# EAGLE schematic PPU_LITE (EAGLE 9.6.2)
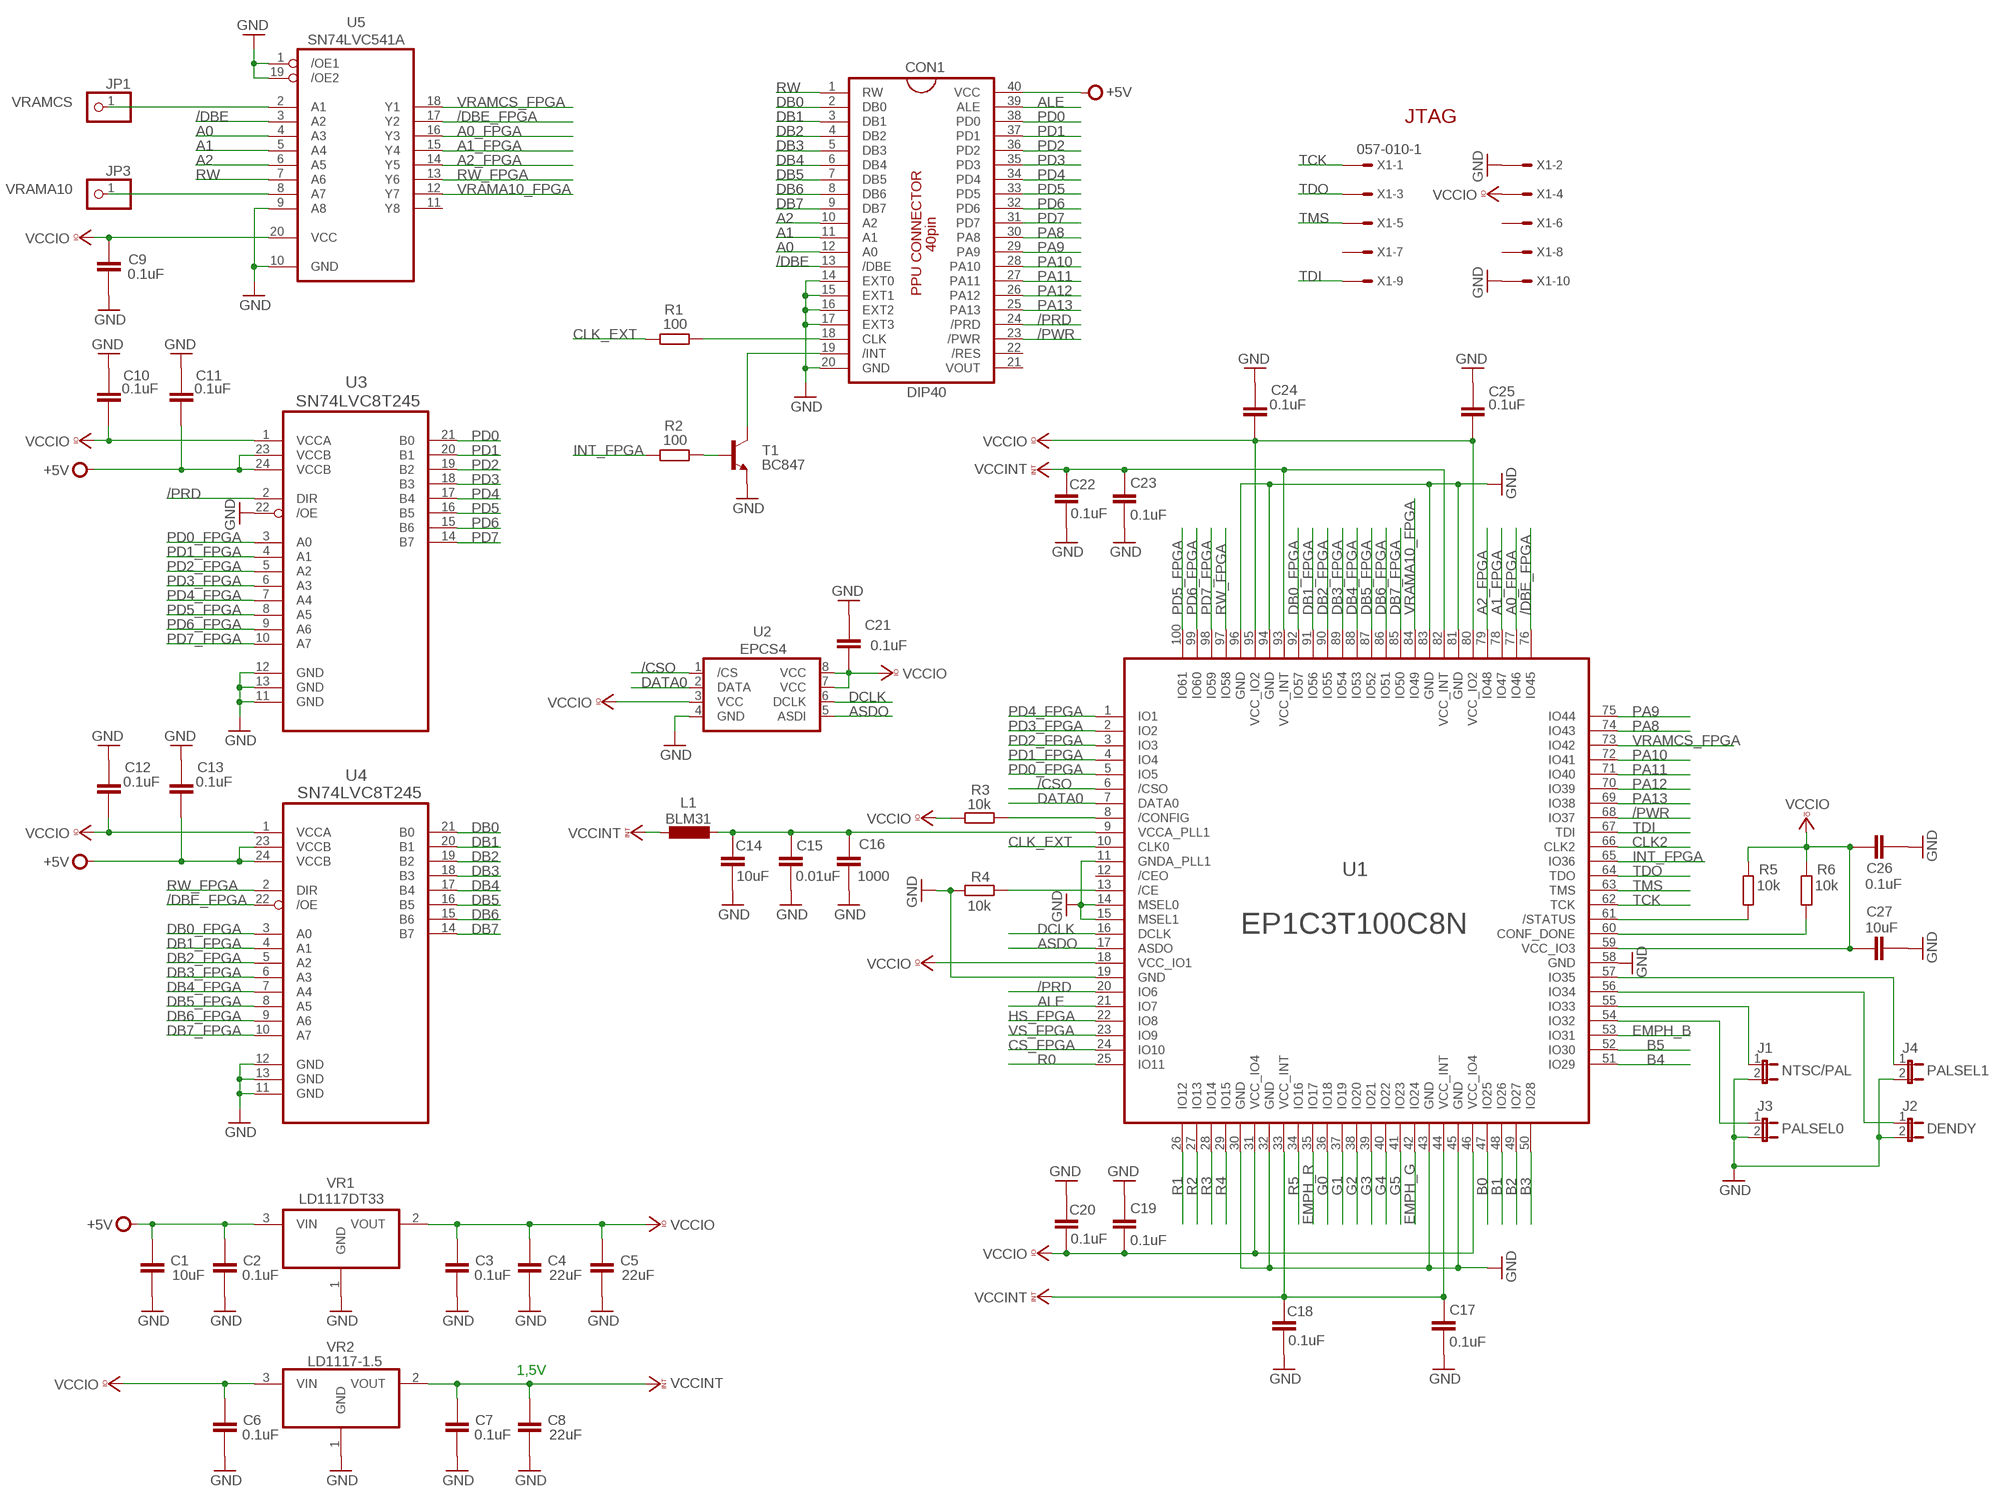
[diagram p0: schematic, sheet 1, part 1 of 2]
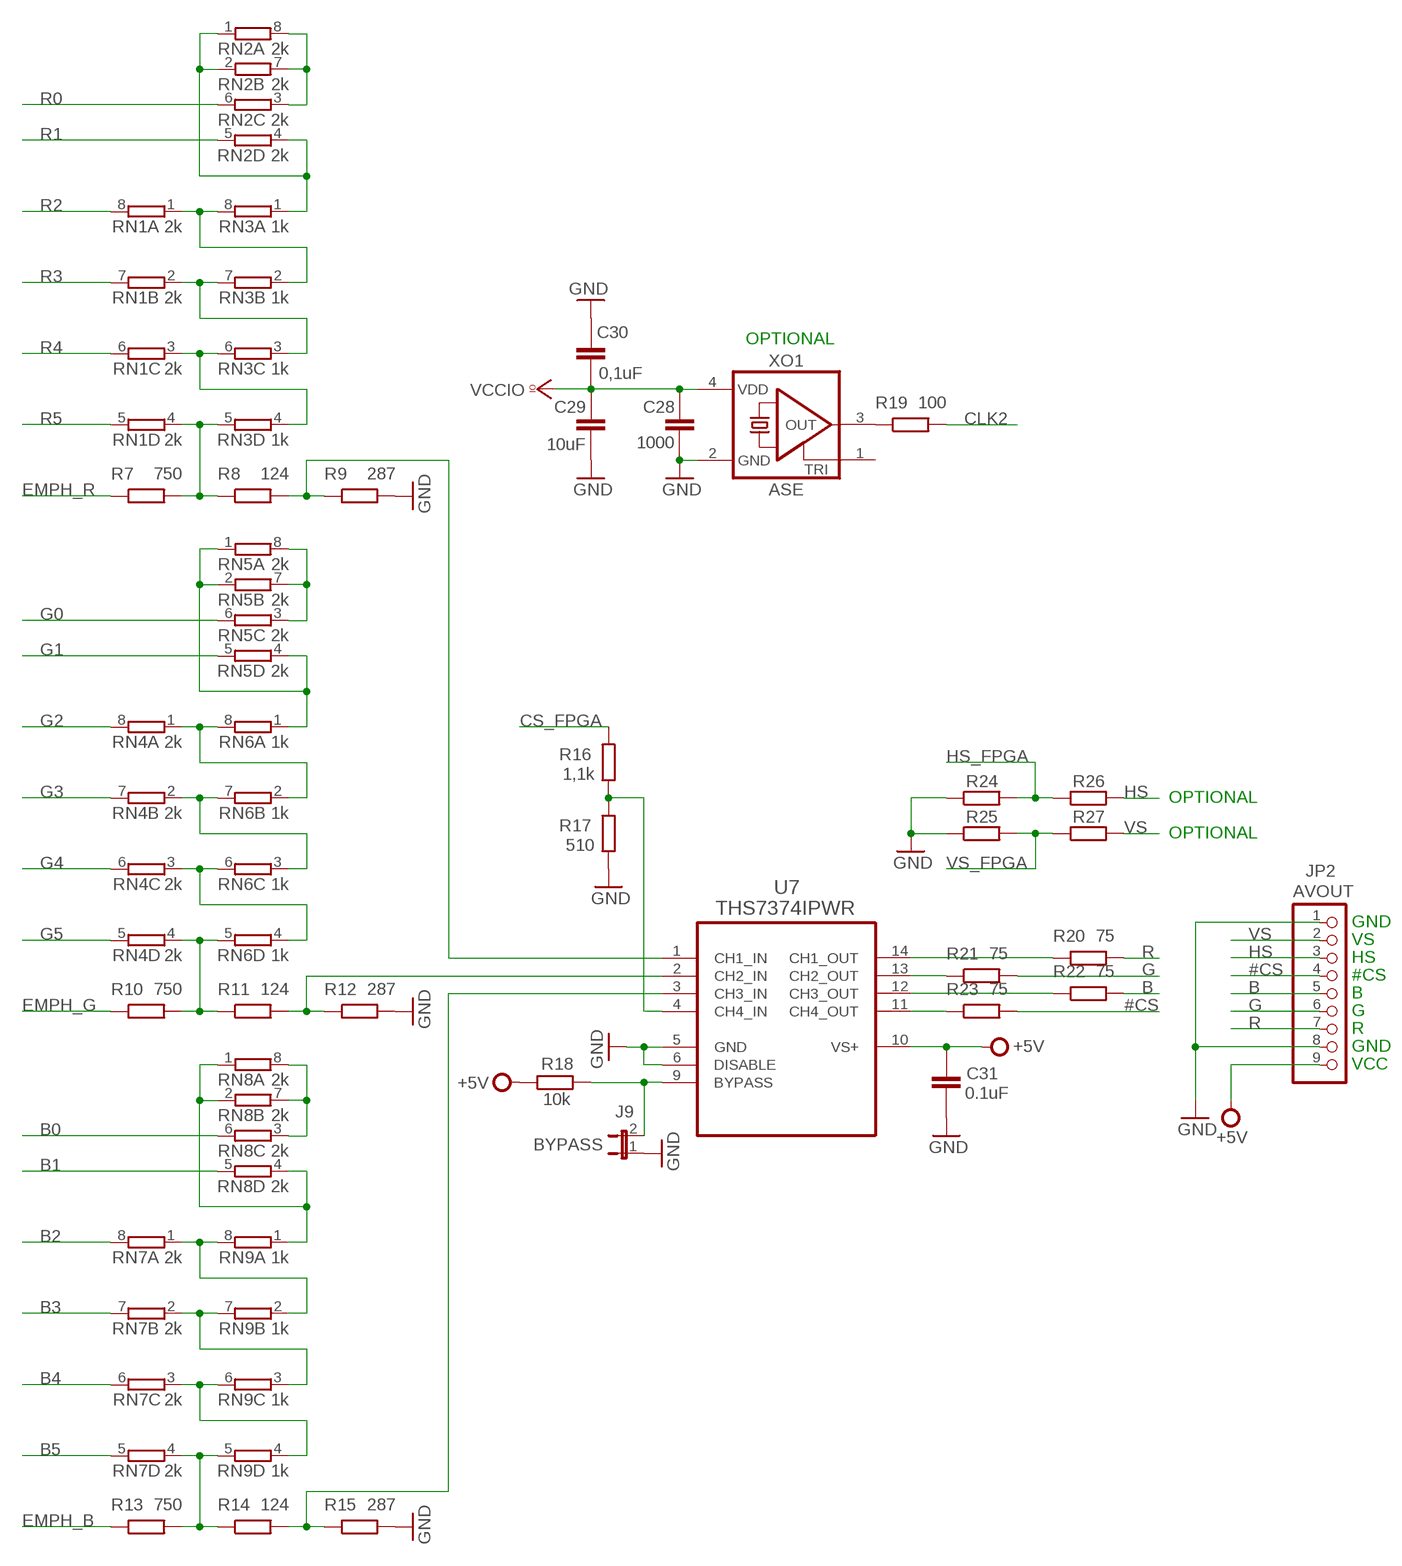
[diagram p1: schematic, sheet 1, part 2 of 2]

## Parts
C1  10uF  C-EUC0603  [C0603]
C2  0.1uF  C-EUC0603  [C0603]
C3  0.1uF  C-EUC0603  [C0603]
C4  22uF  C-EUC0603  [C0603]
C5  22uF  C-EUC0603  [C0603]
C6  0.1uF  C-EUC0603  [C0603]
C7  0.1uF  C-EUC0603  [C0603]
C8  22uF  C-EUC0603  [C0603]
C9  0.1uF  C-EUC0603  [C0603]
C10  0.1uF  C-EUC0603  [C0603]
C11  0.1uF  C-EUC0603  [C0603]
C12  0.1uF  C-EUC0603  [C0603]
C13  0.1uF  C-EUC0603  [C0603]
C14  10uF  C-EUC0603  [C0603]
C15  0.01uF  C-EUC0603  [C0603]
C16  1000  C-EUC0603  [C0603]
C17  0.1uF  C-EUC0603  [C0603]
C18  0.1uF  C-EUC0603  [C0603]
C19  0.1uF  C-EUC0603  [C0603]
C20  0.1uF  C-EUC0603  [C0603]
C21  0.1uF  C-EUC0603  [C0603]
C22  0.1uF  C-EUC0603  [C0603]
C23  0.1uF  C-EUC0603  [C0603]
C24  0.1uF  C-EUC0603  [C0603]
C25  0.1uF  C-EUC0603  [C0603]
C26  0.1uF  C-EUC0603  [C0603]
C27  10uF  C-EUC0603  [C0603]
C28  1000  C-EUC0603  [C0603]
C29  10uF  C-EUC0603  [C0603]
C30  0,1uF  C-EUC0603  [C0603]
C31  0.1uF  C-EUC0603  [C0603]
CON1  DIP40  [DIP-40]
J1  NTSC/PAL  JP1E  [JP1]
J2  DENDY  JP1E  [JP1]
J3  PALSEL0  JP1E  [JP1]
J4  PALSEL1  JP1E  [JP1]
J9  BYPASS  JP1E  [JP1]
JP1  VRAMCS  PINHD-1X1  [1X01]
JP2  AVOUT  PINHD-1X9  [1X09]
JP3  VRAMA10  PINHD-1X1  [1X01]
L1  BLM31  L-EUL0201  [L0201]
R1  100  R-EU_R0805  [R0805]
R2  100  R-EU_R0805  [R0805]
R3  10k  R-EU_R0805  [R0805]
R4  10k  R-EU_R0805  [R0805]
R5  10k  R-EU_R0805  [R0805]
R6  10k  R-EU_R0805  [R0805]
R7  750  R-EU_R0805  [R0805]
R8  124  R-EU_R0805  [R0805]
R9  287  R-EU_R0805  [R0805]
R10  750  R-EU_R0805  [R0805]
R11  124  R-EU_R0805  [R0805]
R12  287  R-EU_R0805  [R0805]
R13  750  R-EU_R0805  [R0805]
R14  124  R-EU_R0805  [R0805]
R15  287  R-EU_R0805  [R0805]
R16  1,1k  R-EU_R0805  [R0805]
R17  510  R-EU_R0805  [R0805]
R18  10k  R-EU_R0805  [R0805]
R19  100  R-EU_R0805  [R0805]
R20  75  R-EU_R0805  [R0805]
R21  75  R-EU_R0805  [R0805]
R22  75  R-EU_R0805  [R0805]
R23  75  R-EU_R0805  [R0805]
R24  R-EU_R0805  [R0805]
R25  R-EU_R0805  [R0805]
R26  R-EU_R0805  [R0805]
R27  R-EU_R0805  [R0805]
RN1  2k  4R-N0603-ARC  [0603-ARC]
RN2  2k  4R-N0603-ARC  [0603-ARC]
RN3  1k  4R-N0603-ARC  [0603-ARC]
RN4  2k  4R-N0603-ARC  [0603-ARC]
RN5  2k  4R-N0603-ARC  [0603-ARC]
RN6  1k  4R-N0603-ARC  [0603-ARC]
RN7  2k  4R-N0603-ARC  [0603-ARC]
RN8  2k  4R-N0603-ARC  [0603-ARC]
RN9  1k  4R-N0603-ARC  [0603-ARC]
T1  BC847  [SOT23]
U1  EP1C3T100C8N  [QFP50P1600X1600X120-100N]
U2  EPCS4  [SO08]
U3  SN74LVC8T245  [SOP65P640X110-24N]
U4  SN74LVC8T245  [SOP65P640X110-24N]
U5  SN74LVC541A  [TSOP20]
U7  THS7374IPWR  [SOP65P640X120-14N]
VR1  LD1117DT33  [DPAK456P1010X240-3N]
VR2  LD1117-1.5  [SOT-223-3]
X1  057-010-1  [057-010-1]
XO1  ASE  [ASE]

## Nets
#CS: JP2.4 R23.2
+5V: C1.2 C2.2 C11.1 C13.1 C31.2 CON1.40(VCC) JP2.9 R18.1 U3.23(VCCB) U3.24(VCCB) U4.23(VCCB) U4.24(VCCB) U7.10(VS+) VR1.3(VIN)
/CSO: U1.6(/CSO) U2.1(/CS)
/DBE: CON1.13(/DBE) U5.3(A2)
/DBE_FPGA: U1.76(IO45) U4.22(/OE) U5.17(Y2)
/PRD: CON1.24(/PRD) U1.20(IO6) U3.2(DIR)
/PWR: CON1.23(/PWR) U1.68(IO37)
A0: CON1.12(A0) U5.4(A3)
A0_FPGA: U1.77(IO46) U5.16(Y3)
A1: CON1.11(A1) U5.5(A4)
A1_FPGA: U1.78(IO47) U5.15(Y4)
A2: CON1.10(A2) U5.6(A5)
A2_FPGA: U1.79(IO48) U5.14(Y5)
ALE: CON1.39(ALE) U1.21(IO7)
ASDO: U1.17(ASDO) U2.5(ASDI)
B: JP2.5 R22.2
B0: RN8.6 U1.47(IO25)
B1: RN8.5 U1.48(IO26)
B2: RN7.8 U1.49(IO27)
B3: RN7.7 U1.50(IO28)
B4: RN7.6 U1.51(IO29)
B5: RN7.5 U1.52(IO30)
CLK2: R19.2 U1.66(CLK2)
CLK_EXT: R1.1 U1.10(CLK0)
CS_FPGA: R16.2 U1.24(IO10)
DATA0: U1.7(DATA0) U2.2(DATA)
DB0: CON1.2(DB0) U4.21(B0)
DB0_FPGA: U1.92(IO57) U4.3(A0)
DB1: CON1.3(DB1) U4.20(B1)
DB1_FPGA: U1.91(IO56) U4.4(A1)
DB2: CON1.4(DB2) U4.19(B2)
DB2_FPGA: U1.90(IO55) U4.5(A2)
DB3: CON1.5(DB3) U4.18(B3)
DB3_FPGA: U1.89(IO54) U4.6(A3)
DB4: CON1.6(DB4) U4.17(B4)
DB4_FPGA: U1.88(IO53) U4.7(A4)
DB5: CON1.7(DB5) U4.16(B5)
DB5_FPGA: U1.87(IO52) U4.8(A5)
DB6: CON1.8(DB6) U4.15(B6)
DB6_FPGA: U1.86(IO51) U4.9(A6)
DB7: CON1.9(DB7) U4.14(B7)
DB7_FPGA: U1.85(IO50) U4.10(A7)
DCLK: U1.16(DCLK) U2.6(DCLK)
EMPH_B: R13.1 U1.53(IO31)
EMPH_G: R10.1 U1.42(IO24)
EMPH_R: R7.1 U1.35(IO17)
G: JP2.6 R21.2
G0: RN5.6 U1.36(IO18)
G1: RN5.5 U1.37(IO19)
G2: RN4.8 U1.38(IO20)
G3: RN4.7 U1.39(IO21)
G4: RN4.6 U1.40(IO22)
G5: RN4.5 U1.41(IO23)
GND: C1.1 C2.1 C3.1 C4.1 C5.1 C6.1 C7.1 C8.1 C9.1 C10.2 C11.2 C12.2 C13.2 C14.1 C15.1 C16.1 C17.1 C18.1 C19.2 C20.2 C21.2 C22.1 C23.1 C24.2 C25.2 C26.1 C27.1 C28.1 C29.1 C30.2 C31.1 CON1.14(EXT0) CON1.15(EXT1) CON1.16(EXT2) CON1.17(EXT3) CON1.20(GND) J1.2 J2.2 J3.2 J4.2 J9.1 JP2.1 JP2.8 R4.1 R9.2 R12.2 R15.2 R17.1 R24.1 R25.1 T1.2(E) U1.11(GNDA_PLL1) U1.14(MSEL0) U1.15(MSEL1) U1.19(GND) U1.30(GND) U1.32(GND) U1.43(GND) U1.45(GND) U1.58(GND) U1.81(GND) U1.83(GND) U1.94(GND) U1.96(GND) U2.4(GND) U3.11(GND) U3.12(GND) U3.13(GND) U3.22(/OE) U4.11(GND) U4.12(GND) U4.13(GND) U5.1(/OE1) U5.9(A8) U5.10(GND) U5.19(/OE2) U7.5(GND) U7.6(DISABLE) VR1.1(GND) VR2.1(GND) X1.2 X1.10 XO1.2(GND)
HS: JP2.3 R26.2
HS_FPGA: R24.2 R26.1 U1.22(IO8)
INT_FPGA: R2.1 U1.65(IO36)
N$1: R5.1 U1.61(/STATUS)
N$2: R6.1 U1.60(CONF_DONE)
N$4: CON1.19(/INT) T1.3(C)
N$5: R2.2 T1.1(B)
N$6: J1.1 U1.55(IO33)
N$7: J2.1 U1.56(IO34)
N$8: J3.1 U1.54(IO32)
N$9: J4.1 U1.57(IO35)
N$10: R4.2 U1.13(/CE)
N$11: R3.2 U1.8(/CONFIG)
N$12: C14.2 C15.2 C16.2 L1.2 U1.9(VCCA_PLL1)
N$13: CON1.18(CLK) R1.2
N$14: R16.1 R17.2 U7.4(CH4_IN)
N$15: J9.2 R18.2 U7.9(BYPASS)
N$16: R19.1 XO1.3(OUT)
N$17: RN7.1 RN9.2 RN9.8
N$18: JP1.1 U5.2(A1)
N$19: JP3.1 U5.8(A7)
N$21: RN8.3 RN8.7 RN8.8
N$22: RN8.1 RN8.2 RN8.4 RN9.1
N$23: RN7.2 RN9.3 RN9.7
N$25: RN4.1 RN6.2 RN6.8
N$26: RN5.3 RN5.7 RN5.8
N$27: RN7.3 RN9.4 RN9.6
N$28: RN5.1 RN5.2 RN5.4 RN6.1
N$29: R13.2 R14.1 RN7.4 RN9.5
N$30: R14.2 R15.1 U7.3(CH3_IN)
N$31: RN4.2 RN6.3 RN6.7
N$32: RN4.3 RN6.4 RN6.6
N$38: R10.2 R11.1 RN4.4 RN6.5
N$44: R11.2 R12.1 U7.2(CH2_IN)
N$45: RN1.1 RN3.2 RN3.8
N$46: RN2.3 RN2.7 RN2.8
N$47: RN2.1 RN2.2 RN2.4 RN3.1
N$50: RN1.2 RN3.3 RN3.7
N$51: RN1.3 RN3.4 RN3.6
N$52: R7.2 R8.1 RN1.4 RN3.5
N$58: R8.2 R9.1 U7.1(CH1_IN)
N$64: R20.1 U7.14(CH1_OUT)
N$65: R21.1 U7.13(CH2_OUT)
N$66: R22.1 U7.12(CH3_OUT)
N$67: R23.1 U7.11(CH4_OUT)
PA8: CON1.30(PA8) U1.74(IO43)
PA9: CON1.29(PA9) U1.75(IO44)
PA10: CON1.28(PA10) U1.72(IO41)
PA11: CON1.27(PA11) U1.71(IO40)
PA12: CON1.26(PA12) U1.70(IO39)
PA13: CON1.25(PA13) U1.69(IO38)
PD0: CON1.38(PD0) U3.21(B0)
PD0_FPGA: U1.5(IO5) U3.3(A0)
PD1: CON1.37(PD1) U3.20(B1)
PD1_FPGA: U1.4(IO4) U3.4(A1)
PD2: CON1.36(PD2) U3.19(B2)
PD2_FPGA: U1.3(IO3) U3.5(A2)
PD3: CON1.35(PD3) U3.18(B3)
PD3_FPGA: U1.2(IO2) U3.6(A3)
PD4: CON1.34(PD4) U3.17(B4)
PD4_FPGA: U1.1(IO1) U3.7(A4)
PD5: CON1.33(PD5) U3.16(B5)
PD5_FPGA: U1.100(IO61) U3.8(A5)
PD6: CON1.32(PD6) U3.15(B6)
PD6_FPGA: U1.99(IO60) U3.9(A6)
PD7: CON1.31(PD7) U3.14(B7)
PD7_FPGA: U1.98(IO59) U3.10(A7)
R: JP2.7 R20.2
R0: RN2.6 U1.25(IO11)
R1: RN2.5 U1.26(IO12)
R2: RN1.8 U1.27(IO13)
R3: RN1.7 U1.28(IO14)
R4: RN1.6 U1.29(IO15)
R5: RN1.5 U1.34(IO16)
RW: CON1.1(RW) U5.7(A6)
RW_FPGA: U1.97(IO58) U4.2(DIR) U5.13(Y6)
TCK: U1.62(TCK) X1.1
TDI: U1.67(TDI) X1.9
TDO: U1.64(TDO) X1.3
TMS: U1.63(TMS) X1.5
VCCINT: C7.2 C8.2 C17.2 C18.2 C22.2 C23.2 L1.1 U1.33(VCC_INT) U1.44(VCC_INT) U1.82(VCC_INT) U1.93(VCC_INT) VR2.2(VOUT)
VCCIO: C3.2 C4.2 C5.2 C6.2 C9.2 C10.1 C12.1 C19.1 C20.1 C21.1 C24.1 C25.1 C26.2 C27.2 C28.2 C29.2 C30.1 R3.1 R5.2 R6.2 U1.18(VCC_IO1) U1.31(VCC_IO4) U1.46(VCC_IO4) U1.59(VCC_IO3) U1.80(VCC_IO2) U1.95(VCC_IO2) U2.3(VCC) U2.7(VCC) U2.8(VCC) U3.1(VCCA) U4.1(VCCA) U5.20(VCC) VR1.2(VOUT) VR2.3(VIN) X1.4 XO1.4(VDD)
VRAMA10_FPGA: U1.84(IO49) U5.12(Y7)
VRAMCS_FPGA: U1.73(IO42) U5.18(Y1)
VS: JP2.2 R27.2
VS_FPGA: R25.2 R27.1 U1.23(IO9)
Unconnected: CON1.21(VOUT) CON1.22(/RES) U1.12(/CEO) U5.11(Y8) X1.6 X1.7 X1.8 XO1.1(TRI)

## Notes on the sheet
- JTAG
- OPTIONAL
- OPTIONAL
- OPTIONAL
- GND
- VS
- HS
- #CS
- B
- G
- R
- GND
- VCC
- 1,5V

## Library data of the parts
C1-C31 = rcl_my:C-EU: CAPACITOR, European symbol; SPICEPREFIX: C
CON1 = SnapEDA-Library:DIP40
J1-J4 J9 = jumper:JP1E: JUMPER
JP1 JP3 = pinhead:PINHD-1X1: PIN HEADER
JP2 = pinhead:PINHD-1X9: PIN HEADER
L1 = rcl_my:L-EU: INDUCTOR, European symbol; SPICEPREFIX: L
R1-R27 = rcl:R-EU_: RESISTOR, European symbol; SPICEPREFIX: R
RN1-RN9 = resistor-dil:4R-N: Array Chip Resistor Source: RS Component / Phycomp; OC_FARNELL: unknown; OC_NEWARK: unknown
T1 = transistor:BC847: NPN TRANSISTOR
U1 = EP1C3T100C8N:EP1C3T100C8N
U2 = EPCS4:EPCS4
U3 U4 = SnapEDA-Library:SN74LVC8T245
U5 = SnapEDA-Library:SN74LVC541A; PACKAGE: TSSOP-20; SUPPLIER: TI
U7 = THS7374IPWR:THS7374IPWR
VR1 = LD1117DT33:LD1117DT33; MANUFACTURER: STMicroelectronics; PARTREV: 33; STANDARD: IPC7351B
VR2 = LD1117-1.5:LD1117-1.5
X1 = con-panduit:057-010-: CONNECTOR 10-pin series 057 contact pc board low profile headers; OC_FARNELL: unknown; OC_NEWARK: unknown
XO1 = crystal:ASE: 3.3Vdc CMOS SMD CRYSTAL CLOCK OSCILLATOR SOurce: www.abracon.com; OC_FARNELL: unknown; OC_NEWARK: unknown